# EAGLE schematic pic (EAGLE 5.01)
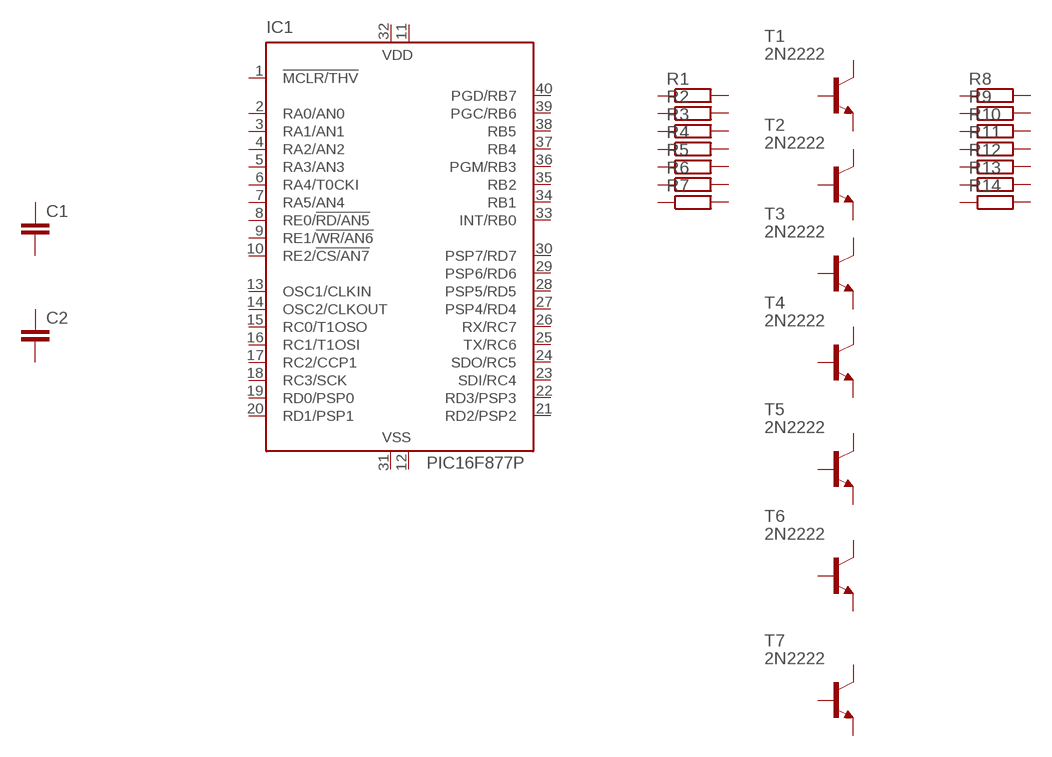
[diagram p0: schematic, sheet 1]

## Parts
C1  C2.5/6  [C2.5-6]
C2  C2.5/6  [C2.5-6]
IC1  PIC16F877P  [DIL40]
R1  R-EU_0613/15  [P0613/15]
R2  R-EU_0613/15  [P0613/15]
R3  R-EU_0613/15  [P0613/15]
R4  R-EU_0613/15  [P0613/15]
R5  R-EU_0613/15  [P0613/15]
R6  R-EU_0613/15  [P0613/15]
R7  R-EU_0613/15  [P0613/15]
R8  R-EU_0613/15  [P0613/15]
R9  R-EU_0613/15  [P0613/15]
R10  R-EU_0613/15  [P0613/15]
R11  R-EU_0613/15  [P0613/15]
R12  R-EU_0613/15  [P0613/15]
R13  R-EU_0613/15  [P0613/15]
R14  R-EU_0613/15  [P0613/15]
T1  2N2222  [TO18]
T2  2N2222  [TO18]
T3  2N2222  [TO18]
T4  2N2222  [TO18]
T5  2N2222  [TO18]
T6  2N2222  [TO18]
T7  2N2222  [TO18]
Unconnected: C1.1 C1.2 C2.1 C2.2 IC1.1(!MCLR/THV) IC1.2(RA0/AN0) IC1.3(RA1/AN1) IC1.4(RA2/AN2) IC1.5(RA3/AN3) IC1.6(RA4/T0CKI) IC1.7(RA5/AN4) IC1.8(RE0/!RD/AN5) IC1.9(RE1/!WR/AN6) IC1.10(RE2/!CS/AN7) IC1.13(OSC1/CLKIN) IC1.14(OSC2/CLKOUT) IC1.15(RC0/T1OSO) IC1.16(RC1/T1OSI) IC1.17(RC2/CCP1) IC1.18(RC3/SCK) IC1.19(RD0/PSP0) IC1.20(RD1/PSP1) IC1.21(RD2/PSP2) IC1.22(RD3/PSP3) IC1.23(SDI/RC4) IC1.24(SDO/RC5) IC1.25(TX/RC6) IC1.26(RX/RC7) IC1.27(PSP4/RD4) IC1.28(PSP5/RD5) IC1.29(PSP6/RD6) IC1.30(PSP7/RD7) IC1.33(INT/RB0) IC1.34(RB1) IC1.35(RB2) IC1.36(PGM/RB3) IC1.37(RB4) IC1.38(RB5) IC1.39(PGC/RB6) IC1.40(PGD/RB7) R1.1 R1.2 R2.1 R2.2 R3.1 R3.2 R4.1 R4.2 R5.1 R5.2 R6.1 R6.2 R7.1 R7.2 R8.1 R8.2 R9.1 R9.2 R10.1 R10.2 R11.1 R11.2 R12.1 R12.2 R13.1 R13.2 R14.1 R14.2 T1.1(E) T1.2(B) T1.3(C) T2.1(E) T2.2(B) T2.3(C) T3.1(E) T3.2(B) T3.3(C) T4.1(E) T4.2(B) T4.3(C) T5.1(E) T5.2(B) T5.3(C) T6.1(E) T6.2(B) T6.3(C) T7.1(E) T7.2(B) T7.3(C)

## Power pins joined to a net without a drawn wire
VDD: IC1.11(VDD) IC1.32(VDD)
VSS: IC1.12(VSS) IC1.31(VSS)

## Library data of the parts
C1 C2 = capacitor-wima:C: CAPACITOR naming: grid - package width
IC1 = microchip:PIC16F87*: MICROCONTROLLER
R1-R14 = resistor:R-EU_: RESISTOR, European symbol
T1-T7 = transistor:2N2222: NPN TRANSISTOR